# Altium schematic sheet PAM8610.SchDoc
size A3
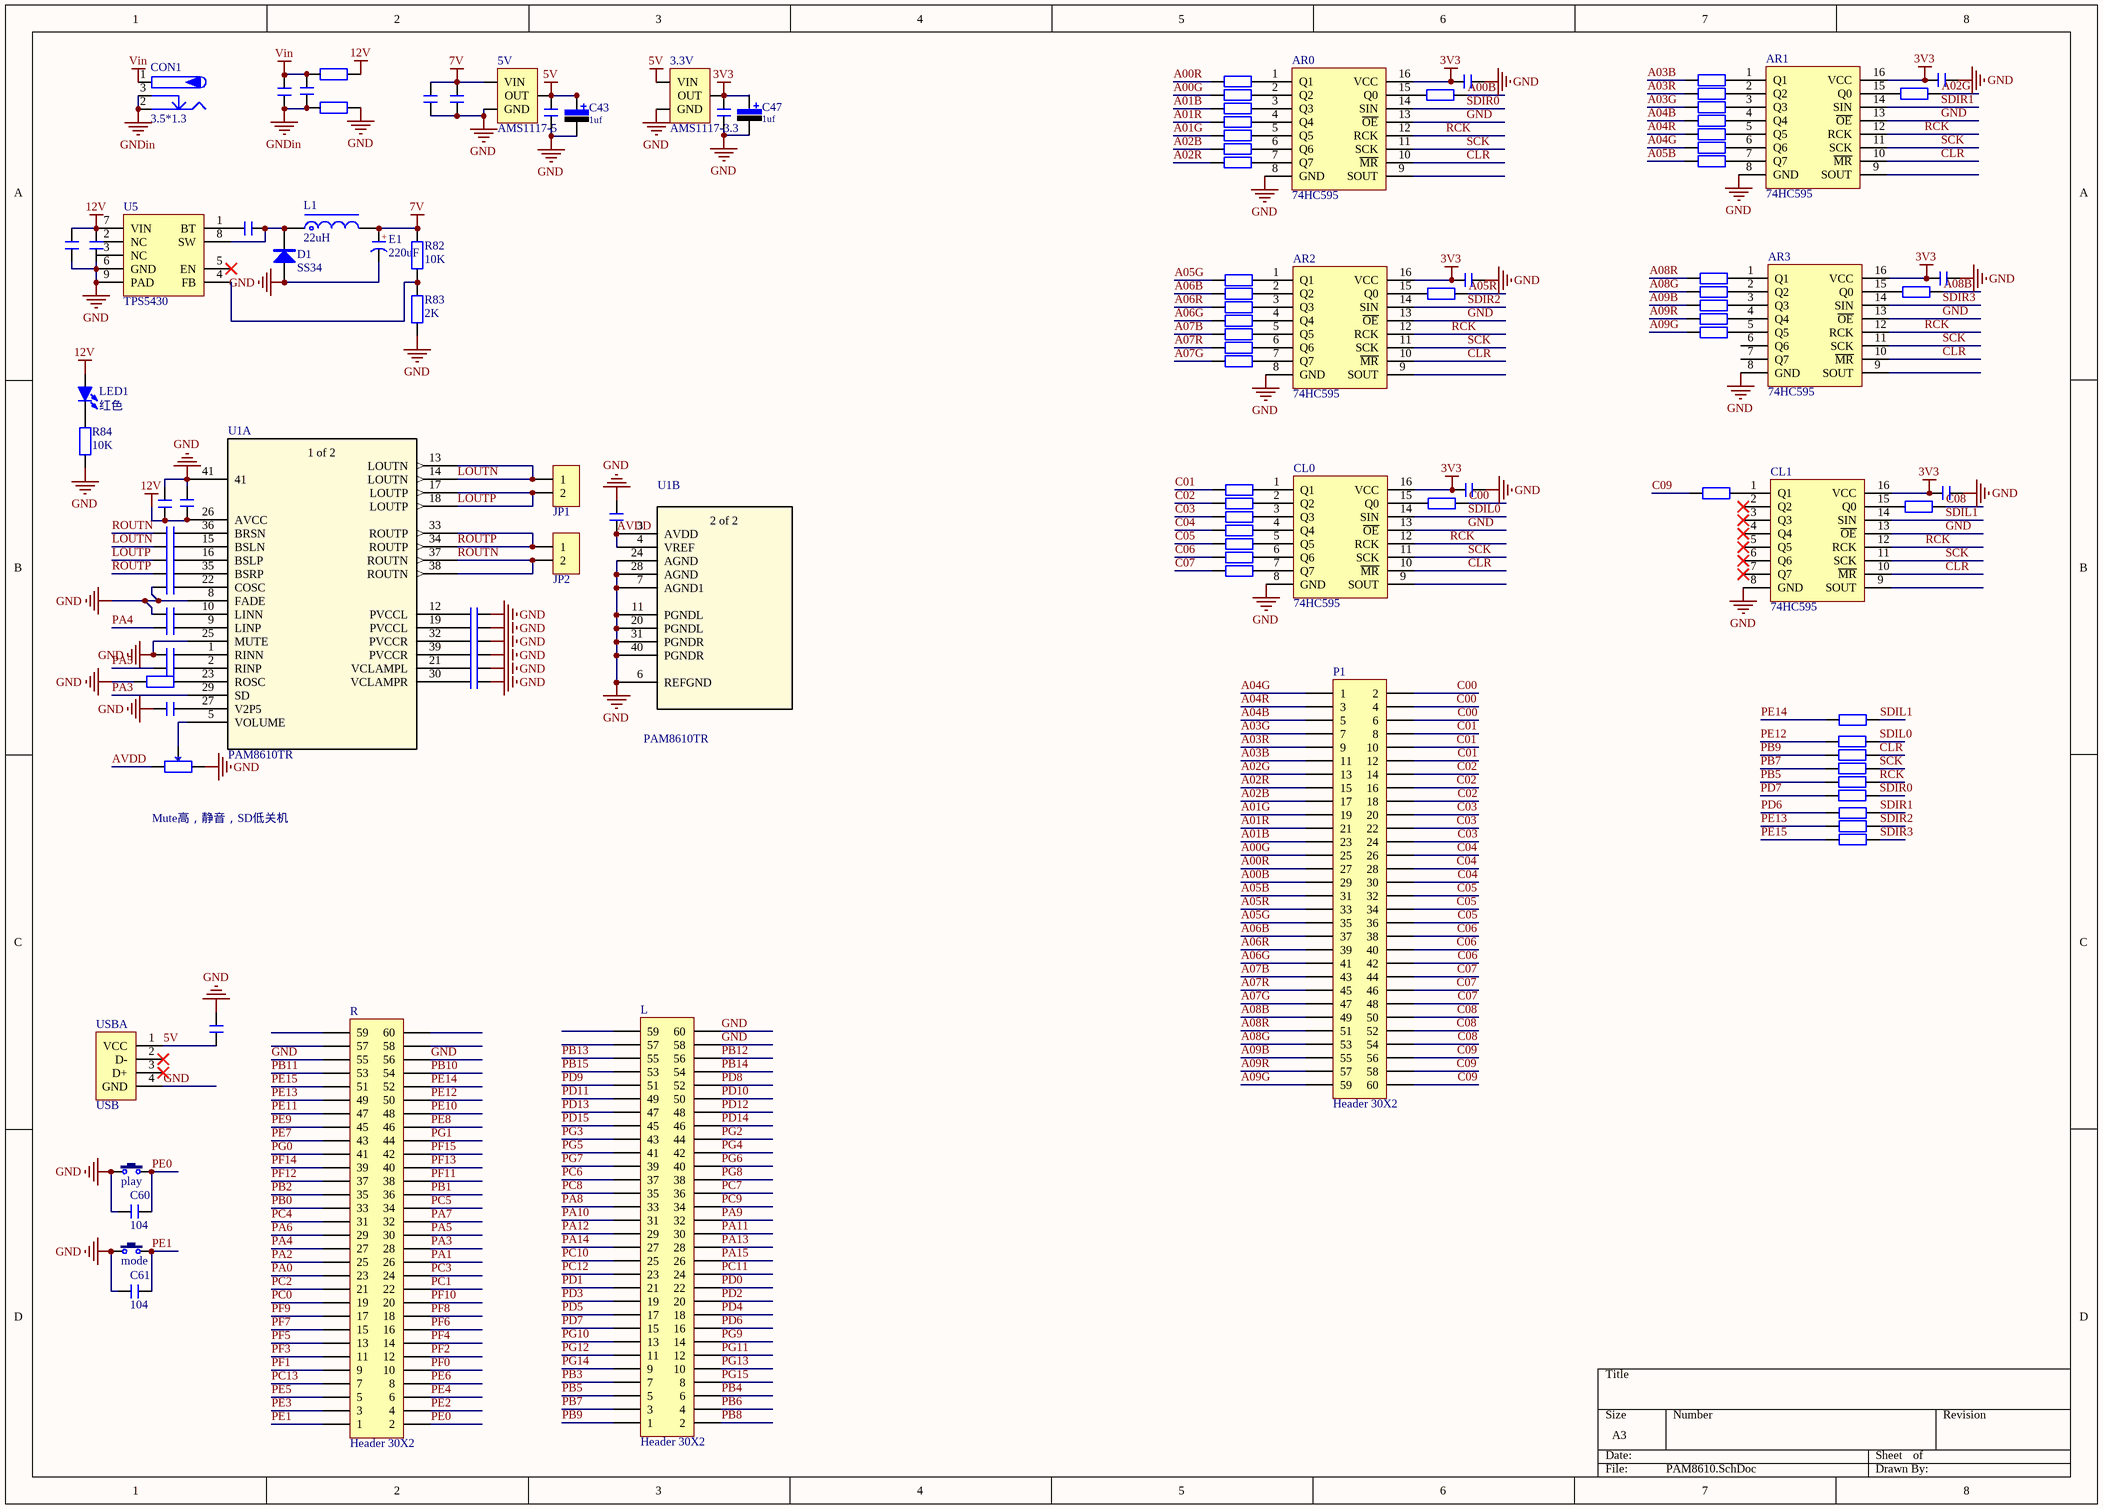
[diagram p0: PAM8610.SchDoc]

## Parts
3.3V  AMS1117-3.3  [SOT-223]
5V  AMS1117-5  [SOT-223]
AR0  74HC595  [TSSOP16_M]
AR1  74HC595  [TSSOP16_M]
AR2  74HC595  [TSSOP16_M]
AR3  74HC595  [TSSOP16_M]
C4  105  [C 0603_L]  (value not drawn)
C5  105  [C 0603_L]  (value not drawn)
C6  105  [C 0603_L]  (value not drawn)
C7  105  [C 0603_L]  (value not drawn)
C9  105  [C 0603_L]  (value not drawn)
C10  105  [C 0603_L]  (value not drawn)
C15  100nF  [C 0603_L]  (value not drawn)
C16  220pF  [C 0603_L]  (value not drawn)
C17  1uF  [C 0603_L]  (value not drawn)
C18  1uF  [C 0603_L]  (value not drawn)
C19  1uF  [C 0603_L]  (value not drawn)
C20  1uF  [C 0603_L]  (value not drawn)
C21  1uF  [C 0603_L]  (value not drawn)
C23  10uF  [C 0603_L]  (value not drawn)
C24  1uF  [C 0603_L]  (value not drawn)
C25  1uF  [C 0603_L]  (value not drawn)
C26  1uF  [C 0603_L]  (value not drawn)
C27  1uF  [C 0603_L]  (value not drawn)
C28  1uF  [C 0603_L]  (value not drawn)
C29  1uF  [C 0603_L]  (value not drawn)
C30  1uF  [C 0603_L]  (value not drawn)
C31  1uF  [C 0603_L]  (value not drawn)
C32  1uF  [C 0603_L]  (value not drawn)
C33  1uF  [C 0603_L]  (value not drawn)
C34  1uF  [C 0603_L]  (value not drawn)
C36  10uF  [C 0603_L]  (value not drawn)
C37  100nF  [C 0603_L]  (value not drawn)
C40  100nF  [C 0603_L]  (value not drawn)
C41  10uF  [C 0603_L]  (value not drawn)
C42  100nF  [C 0603_L]  (value not drawn)
C43  value 1uf  [C-AVX-3528]  (hidden comment: C)
C46  100nF  [C 0603_L]  (value not drawn)
C47  value 1uf  [C-AVX-3528]  (hidden comment: C)
C51  10uF  [C 0603_L]  (value not drawn)
C52  100nF  [C 0603_L]  (value not drawn)
C53  10nF  [C 0603_L]  (value not drawn)
C59  100nF  [C 0603_L]  (value not drawn)
C60  104  [C 0603_L]
C61  104  [C 0603_L]
CL0  74HC595  [TSSOP16_M]
CL1  74HC595  [TSSOP16_M]
CON1  3.5*1.3  [DC-005]
D1  SS34  [SMA]
E1  220uF  [CT 8*7 - C]
FB1  600R  [FB-0805]  (value not drawn)
FB2  600R  [FB-0805]  (value not drawn)
JP1  HDR-1X2  [HDR2.54-LI-2P]  (value not drawn)
JP2  HDR-1X2  [HDR2.54-LI-2P]  (value not drawn)
L  Header 30X2  [HDR2X30]
L1  22uH  [CDRH74]
LED1  红色  [LED 0603B]
mode  3x6x5  [TSW SMD-3*6*2.5]  (value not drawn)
P1  Header 30X2  [HDR2X30]
play  3x6x5  [TSW SMD-3*6*2.5]  (value not drawn)
R  Header 30X2  [HDR2X30]
R0  220  [R 0603_L]  (value not drawn)
R1  220  [R 0603_L]  (value not drawn)
R2  220  [R 0603_L]  (value not drawn)
R3  220  [R 0603_L]  (value not drawn)
R4  220  [R 0603_L]  (value not drawn)
R5  220  [R 0603_L]  (value not drawn)
R6  220  [R 0603_L]  (value not drawn)
R7  220  [R 0603_L]  (value not drawn)
R8  220  [R 0603_L]  (value not drawn)
R9  220  [R 0603_L]  (value not drawn)
R10  220  [R 0603_L]  (value not drawn)
R11  220  [R 0603_L]  (value not drawn)
R12  220  [R 0603_L]  (value not drawn)
R13  220  [R 0603_L]  (value not drawn)
R14  220  [R 0603_L]  (value not drawn)
R15  220  [R 0603_L]  (value not drawn)
R16  220  [R 0603_L]  (value not drawn)
R17  220  [R 0603_L]  (value not drawn)
R18  220  [R 0603_L]  (value not drawn)
R19  220  [R 0603_L]  (value not drawn)
R20  220  [R 0603_L]  (value not drawn)
R21  220  [R 0603_L]  (value not drawn)
R22  220  [R 0603_L]  (value not drawn)
R23  220  [R 0603_L]  (value not drawn)
R24  220  [R 0603_L]  (value not drawn)
R25  220  [R 0603_L]  (value not drawn)
R26  220  [R 0603_L]  (value not drawn)
R27  220  [R 0603_L]  (value not drawn)
R28  220  [R 0603_L]  (value not drawn)
R29  220  [R 0603_L]  (value not drawn)
R40  220  [R 0603_L]  (value not drawn)
R41  220  [R 0603_L]  (value not drawn)
R42  220  [R 0603_L]  (value not drawn)
R43  220  [R 0603_L]  (value not drawn)
R44  220  [R 0603_L]  (value not drawn)
R45  220  [R 0603_L]  (value not drawn)
R46  220  [R 0603_L]  (value not drawn)
R47  220  [R 0603_L]  (value not drawn)
R48  220  [R 0603_L]  (value not drawn)
R49  220  [R 0603_L]  (value not drawn)
R72  120K  [R 0603_L]  (value not drawn)
R82  10K  [R 0603_L]
R83  2K  [R 0603_L]
R84  10K  [R 0603_L]
R143  47  [R 0603_L]  (value not drawn)
R144  47  [R 0603_L]  (value not drawn)
R145  47  [R 0603_L]  (value not drawn)
R146  47  [R 0603_L]  (value not drawn)
R147  47  [R 0603_L]  (value not drawn)
R148  47  [R 0603_L]  (value not drawn)
R149  47  [R 0603_L]  (value not drawn)
R150  47  [R 0603_L]  (value not drawn)
R151  47  [R 0603_L]  (value not drawn)
RP1  200K  [3362P]  (value not drawn)
U1  PAM8610TR  [QFN_610TR_DIO]  (parts A,B of 2)
U5  TPS5430  [SOP-8 with pad]
USBA  USB  [USB-A/S_B]

## Nets
3V3: 3.3V.2(OUT) AR0.16(VCC) AR1.16(VCC) AR2.16(VCC) AR3.16(VCC) C4.1 C5.1 C6.1 C7.1 C9.1 C10.1 C46.2 C47.1 CL0.16(VCC) CL1.16(VCC)
5V: 3.3V.3(VIN) 5V.2(OUT) C42.2 C43.1 C59.2 USBA.1(VCC)
7V: 5V.3(VIN) C40.2 C41.2 E1.1(A) L1.2 R82.2
12V: C15.1 C23.1 C51.2 C52.2 FB1.2 LED1.1(A) U1.26(AVCC) U5.7(VIN)
GND: 3.3V.1(GND) 5V.1(GND) AR0.8(GND) AR0.13(~{OE}) AR1.8(GND) AR1.13(~{OE}) AR2.8(GND) AR2.13(~{OE}) AR3.8(GND) AR3.13(~{OE}) C4.2 C5.2 C6.2 C7.2 C9.2 C10.2 C15.2 C16.1 C17.1 C19.1 C21.1 C23.2 C24.2 C29.1 C30.1 C31.1 C32.1 C33.1 C34.1 C40.1 C41.1 C42.1 C43.2 C46.1 C47.2 C51.1 C52.1 C59.1 C60.1 C61.1 CL0.8(GND) CL0.13(~{OE}) CL1.8(GND) CL1.13(~{OE}) D1.1(A) E1.2(K) FB2.2 L.58 L.60 mode.1 play.1 R.55 R.56 R72.1 R83.1 R84.1 RP1.3 U1.6(REFGND) U1.7(AGND1) U1.8(FADE) U1.11(PGNDL) U1.20(PGNDL) U1.24(AGND) U1.25(MUTE) U1.28(AGND) U1.31(PGNDR) U1.40(PGNDR) U1.41 U5.6(GND) U5.9(PAD) USBA.4(GND)
GNDin: C36.1 C37.1 CON1.2 CON1.3 FB2.1
Vin: C36.2 C37.2 CON1.1 FB1.1
A00B: P1.29 R0.2
A00G: P1.25 R2.1
A00R: P1.27 R1.1
A01B: P1.23 R3.1
A01G: P1.19 R5.1
A01R: P1.21 R4.1
A02B: P1.17 R6.1
A02G: P1.13 R8.2
A02R: P1.15 R7.1
A03B: P1.11 R9.1
A03G: P1.7 R11.1
A03R: P1.9 R10.1
A04B: P1.5 R12.1
A04G: P1.1 R14.1
A04R: P1.3 R13.1
A05B: P1.31 R15.1
A05G: P1.35 R17.1
A05R: P1.33 R16.2
A06B: P1.37 R18.1
A06G: P1.41 R20.1
A06R: P1.39 R19.1
A07B: P1.43 R21.1
A07G: P1.47 R23.1
A07R: P1.45 R22.1
A08B: P1.49 R24.2
A08G: P1.53 R26.1
A08R: P1.51 R25.1
A09B: P1.55 R27.1
A09G: P1.59 R29.1
A09R: P1.57 R28.1
AVDD: C24.1 RP1.1 U1.3(AVDD) U1.4(VREF)
C00: P1.2 P1.4 P1.6 R40.2
C01: P1.8 P1.10 P1.12 R41.1
C02: P1.14 P1.16 P1.18 R42.1
C03: P1.20 P1.22 P1.24 R43.1
C04: P1.26 P1.28 P1.30 R44.1
C05: P1.32 P1.34 P1.36 R45.1
C06: P1.38 P1.40 P1.42 R46.1
C07: P1.44 P1.46 P1.48 R47.1
C08: P1.50 P1.52 P1.54 R48.2
C09: P1.56 P1.58 P1.60 R49.1
CLR: AR0.10(~{MR}) AR1.10(~{MR}) AR2.10(~{MR}) AR3.10(~{MR}) CL0.10(~{MR}) CL1.10(~{MR}) R145.2
LOUTN: C27.2 JP1.1 U1.13(LOUTN) U1.14(LOUTN)
LOUTP: C26.2 JP1.2 U1.17(LOUTP) U1.18(LOUTP)
PA0: R.23
PA1: R.26
PA2: R.25
PA3: R.28 U1.29(SD)
PA4: C18.1 R.27
PA5: C20.1 R.30
PA6: R.29
PA7: R.32
PA8: L.33
PA9: L.32
PA10: L.31
PA11: L.30
PA12: L.29
PA13: L.28
PA14: L.27
PA15: L.26
PB0: R.33
PB1: R.36
PB2: R.35
PB3: L.7
PB4: L.6
PB5: L.5 R147.1
PB6: L.4
PB7: L.3 R146.1
PB8: L.2
PB9: L.1 R145.1
PB10: R.54
PB11: R.53
PB12: L.56
PB13: L.55
PB14: L.54
PB15: L.53
PC0: R.19
PC1: R.22
PC2: R.21
PC3: R.24
PC4: R.31
PC5: R.34
PC6: L.37
PC7: L.36
PC8: L.35
PC9: L.34
PC10: L.25
PC11: L.24
PC12: L.23
PC13: R.7
PD0: L.22
PD1: L.21
PD2: L.20
PD3: L.19
PD4: L.18
PD5: L.17
PD6: L.16 R149.1
PD7: L.15 R148.1
PD8: L.52
PD9: L.51
PD10: L.50
PD11: L.49
PD12: L.48
PD13: L.47
PD14: L.46
PD15: L.45
PE0: C60.2 play.2 R.2
PE1: C61.2 mode.2 R.1
PE2: R.4
PE3: R.3
PE4: R.6
PE5: R.5
PE6: R.8
PE7: R.43
PE8: R.46
PE9: R.45
PE10: R.48
PE11: R.47
PE12: R.50 R144.1
PE13: R.49 R150.1
PE14: R.52 R143.1
PE15: R.51 R151.1
PF0: R.10
PF1: R.9
PF2: R.12
PF3: R.11
PF4: R.14
PF5: R.13
PF6: R.16
PF7: R.15
PF8: R.18
PF9: R.17
PF10: R.20
PF11: R.38
PF12: R.37
PF13: R.40
PF14: R.39
PF15: R.42
PG0: R.41
PG1: R.44
PG2: L.44
PG3: L.43
PG4: L.42
PG5: L.41
PG6: L.40
PG7: L.39
PG8: L.38
PG9: L.14
PG10: L.13
PG11: L.12
PG12: L.11
PG13: L.10
PG14: L.9
PG15: L.8
RCK: AR0.12(RCK) AR1.12(RCK) AR2.12(RCK) AR3.12(RCK) CL0.12(RCK) CL1.12(RCK) R147.2
ROUTN: C28.2 JP2.2 U1.37(ROUTN) U1.38(ROUTN)
ROUTP: C25.2 JP2.1 U1.33(ROUTP) U1.34(ROUTP)
SCK: AR0.11(SCK) AR1.11(SCK) AR2.11(SCK) AR3.11(SCK) CL0.11(SCK) CL1.11(SCK) R146.2
SDIL0: CL0.14(SIN) R144.2
SDIL1: CL1.14(SIN) R143.2
SDIR0: AR0.14(SIN) R148.2
SDIR1: AR1.14(SIN) R149.2
SDIR2: AR2.14(SIN) R150.2
SDIR3: AR3.14(SIN) R151.2
NetAR0_1: AR0.1(Q1) R1.2
NetAR0_2: AR0.2(Q2) R2.2
NetAR0_3: AR0.3(Q3) R3.2
NetAR0_4: AR0.4(Q4) R4.2
NetAR0_5: AR0.5(Q5) R5.2
NetAR0_6: AR0.6(Q6) R6.2
NetAR0_7: AR0.7(Q7) R7.2
NetAR0_15: AR0.15(Q0) R0.1
NetAR1_1: AR1.1(Q1) R9.2
NetAR1_2: AR1.2(Q2) R10.2
NetAR1_3: AR1.3(Q3) R11.2
NetAR1_4: AR1.4(Q4) R12.2
NetAR1_5: AR1.5(Q5) R13.2
NetAR1_6: AR1.6(Q6) R14.2
NetAR1_7: AR1.7(Q7) R15.2
NetAR1_15: AR1.15(Q0) R8.1
NetAR2_1: AR2.1(Q1) R17.2
NetAR2_2: AR2.2(Q2) R18.2
NetAR2_3: AR2.3(Q3) R19.2
NetAR2_4: AR2.4(Q4) R20.2
NetAR2_5: AR2.5(Q5) R21.2
NetAR2_6: AR2.6(Q6) R22.2
NetAR2_7: AR2.7(Q7) R23.2
NetAR2_15: AR2.15(Q0) R16.1
NetAR3_1: AR3.1(Q1) R25.2
NetAR3_2: AR3.2(Q2) R26.2
NetAR3_3: AR3.3(Q3) R27.2
NetAR3_4: AR3.4(Q4) R28.2
NetAR3_5: AR3.5(Q5) R29.2
NetAR3_15: AR3.15(Q0) R24.1
NetC16_2: C16.2 U1.22(COSC)
NetC17_2: C17.2 U1.10(LINN)
NetC18_2: C18.2 U1.9(LINP)
NetC19_2: C19.2 U1.1(RINN)
NetC20_2: C20.2 U1.2(RINP)
NetC21_2: C21.2 U1.27(V2P5)
NetC25_1: C25.1 U1.35(BSRP)
NetC26_1: C26.1 U1.16(BSLP)
NetC27_1: C27.1 U1.15(BSLN)
NetC28_1: C28.1 U1.36(BRSN)
NetC29_2: C29.2 U1.21(VCLAMPL)
NetC30_2: C30.2 U1.30(VCLAMPR)
NetC31_2: C31.2 U1.39(PVCCR)
NetC32_2: C32.2 U1.32(PVCCR)
NetC33_2: C33.2 U1.19(PVCCL)
NetC34_2: C34.2 U1.12(PVCCL)
NetC53_1: C53.1 D1.2(K) L1.1 U5.8(SW)
NetC53_2: C53.2 U5.1(BT)
NetCL0_1: CL0.1(Q1) R41.2
NetCL0_2: CL0.2(Q2) R42.2
NetCL0_3: CL0.3(Q3) R43.2
NetCL0_4: CL0.4(Q4) R44.2
NetCL0_5: CL0.5(Q5) R45.2
NetCL0_6: CL0.6(Q6) R46.2
NetCL0_7: CL0.7(Q7) R47.2
NetCL0_15: CL0.15(Q0) R40.1
NetCL1_1: CL1.1(Q1) R49.2
NetCL1_15: CL1.15(Q0) R48.1
NetLED1_2: LED1.2(K) R84.2
NetR72_2: R72.2 U1.23(ROSC)
NetR82_1: R82.1 R83.2 U5.4(FB)
NetRP1_2: RP1.2 U1.5(VOLUME)

Not connected (* = marked no-connect by the designer): AR0 9(SOUT); AR1 9(SOUT); AR2 9(SOUT); AR3 6(Q6) 7(Q7) 9(SOUT); CL0 9(SOUT); CL1 2(Q2)* 3(Q3)* 4(Q4)* 5(Q5)* 6(Q6)* 7(Q7)* 9(SOUT); L 57 59; R 57 58 59 60; U5 2(NC) 3(NC) 5(EN)*; USBA 2(D-)* 3(D+)*

## Notes on the sheet
- (near RP1) Mute高，静音，SD低关机
- (in symbol C-CT) +
- (in symbol PAM8610TR_1, part A) 1 of 2
- (in symbol PAM8610TR_1, part B) 2 of 2

## Library data of the parts
3.3V 5V = AMS1117
AR0-AR3 CL0 CL1 = 74HC595: 8位移位寄存器; 版权归属: 源创客; BOM名称: 8位移位寄存器; 学习资源: www.ooocke.com
C4-C7 C9 C10 C15-C21 C23-C34 C36 C37 C40-C42 C46 C51-C53 C59-C61 = C: 无极性贴片电容; 版权归属: 源创客; BOM名称: 无极性贴片电容; 学习资源: www.ooocke.com
C43 C47 = Cap-Ta: 极性钽电容
CON1 = P-DC: 低压电源接口; BOM名称: DC电源接口; 版权归属: 源创客; 学习资源: www.ooocke.com
D1 = SS34: 肖特基二极管; 版权归属: 源创客; 属性: 40V/3A; BOM名称: 肖特基二极管; 学习资源: www.ooocke.com
E1 = C-CT: 贴片固态电容; 版权归属: 源创客; BOM名称: 贴片固态电容; 学习资源: www.ooocke.com
FB1 FB2 = FB: 磁珠
JP1 JP2 = Header 2: 2P接插件; 版权归属: 源创客; BOM名称: 2P接插件; 学习资源: www.ooocke.com
L P1 R = Header 30X2: Header, 30-Pin, Dual row; LatestRevisionDate: 17-Jul-2002; LatestRevisionNote: Re-released for DXP Platform.; Publisher: Altium Limited
L1 = L-CDRH: 功率屏蔽电感; 版权归属: 源创客; BOM名称: 功率屏蔽电感; 学习资源: www.ooocke.com
LED1 = LED-SMD: 贴片LED; 版权归属: 源创客; BOM名称: 贴片LED; 学习资源: www.ooocke.com
mode play = TSW 3x6: 3x6轻触开关; 版权归属: 源创客; BOM名称: 3x6轻触开关; 学习资源: www.ooocke.com
R0-R29 R40-R49 R72 R82-R84 R143-R151 = R: 贴片电阻; 版权归属: 源创客; BOM名称: 贴片电阻; 学习资源: www.ooocke.com
RP1 = RP-ID: 插件单联电位器; BOM名称: 插件电位器; 版权归属: 源创客; 学习资源: www.ooocke.com
U1 = PAM8610TR_1: D类功放; Mfr_Name: Diodes Inc; Copyright: Copyright (C) 2021 Ultra Librarian. All rights reserved.; Manufacturer_Part_Number: PAM8610TR; RefDes: RefDes; Type: DEV
USBA = USB-A/S: USB-A型母接口; 版权归属: 源创客; BOM名称: USB-A型母接口; 学习资源: www.ooocke.com